# Altium schematic sheet AppregiatorManager.SCHDOC
size B; Organization: Altium Limited; Address1: L3, 12a Rodborough Rd; Address2: Frenchs Forest; Address3: NSW; Address4: Australia 2086; DocumentNumber: 6; SheetNumber: 6; SheetTotal: 9
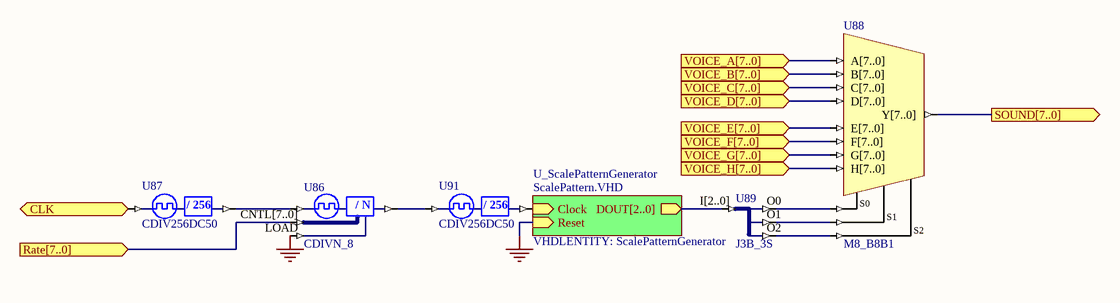
[diagram p0: AppregiatorManager.SCHDOC]

## Parts
U86  CDIVN_8
U87  CDIV256DC50
U88  M8_B8B1
U89  J3B_3S
U91  CDIV256DC50

## Sub-sheets
U_ScalePatternGenerator = ScalePattern.VHD: Clock (in), DOUT[2..0] (out), Reset (in)  | VHDLENTITY: ScalePatternGenerator

## Ports
CLK (in), Rate[7..0] (in), SOUND[7..0] (out), VOICE_A[7..0] (in), VOICE_B[7..0] (in), VOICE_C[7..0] (in), VOICE_D[7..0] (in), VOICE_E[7..0] (in), VOICE_F[7..0] (in), VOICE_G[7..0] (in), VOICE_H[7..0] (in)

## Nets
GND: U86.LOAD ; sheet U_ScalePatternGenerator/Reset
CLK: U87.CLKIN ; port CLK
Rate[7..0]: U86.CNTL[7..0] ; port Rate[7..0]
SOUND[7..0]: U88.Y[7..0] ; port SOUND[7..0]
VOICE_A[7..0]: U88.A[7..0] ; port VOICE_A[7..0]
VOICE_B[7..0]: U88.B[7..0] ; port VOICE_B[7..0]
VOICE_C[7..0]: U88.C[7..0] ; port VOICE_C[7..0]
VOICE_D[7..0]: U88.D[7..0] ; port VOICE_D[7..0]
VOICE_E[7..0]: U88.E[7..0] ; port VOICE_E[7..0]
VOICE_F[7..0]: U88.F[7..0] ; port VOICE_F[7..0]
VOICE_G[7..0]: U88.G[7..0] ; port VOICE_G[7..0]
VOICE_H[7..0]: U88.H[7..0] ; port VOICE_H[7..0]
NetU86_CLKDV: U86.CLKDV U91.CLKIN
NetU86_CLKIN: U86.CLKIN U87.CLKDV
NetU88_S0: U88.S0 U89.O0
NetU88_S1: U88.S1 U89.O1
NetU88_S2: U88.S2 U89.O2
NetU89_I[2..0]: U89.I[2..0] ; sheet U_ScalePatternGenerator/DOUT[2..0]
NetU91_CLKDV: U91.CLKDV ; sheet U_ScalePatternGenerator/Clock

## Notes on the sheet
- Title
- Size:
- Date:
- B
- Number:
- Time:
- Revision:
- Sheet
- of
- File:
- (in symbol CDIV256DC50) / 256
- (in symbol CDIVN_8) / N

## Library data of the parts
U86 = CDIVN_8: 8-Bit Programmable Clock Divider; ArchiveName: GENERIC; Published: 18-Dec-2003; Publisher: Altium Limited; Core Revision: 1.00.00
U87 U91 = CDIV256DC50: Clock Divider by 256 with 50% Duty Cycle Output; ArchiveName: GENERIC; Published: 18-Dec-2003; Publisher: Altium Limited; Core Revision: 1.00.00
U88 = M8_B8B1: 8x8-Bit Bus to 1x8-Bit Bus Multiplexer; ArchiveName: GENERIC; Published: 18-Nov-2003; Publisher: Altium Limited; Core Revision: 1.00.00
U89 = J3B_3S: 3-Bit input bus to 3 Single pin outputs; ArchiveName: GENERIC; Published: 18-Dec-2003; Publisher: Altium Limited; Core Revision: 1.00.00